# EasyEDA schematic SCH_ESC-capstone_2025-07-27.json
TITLE: ESC-capstone; REV: 1.0; Date: 2025-07-23; Sheet: 1/1; Drawn By: Atithep
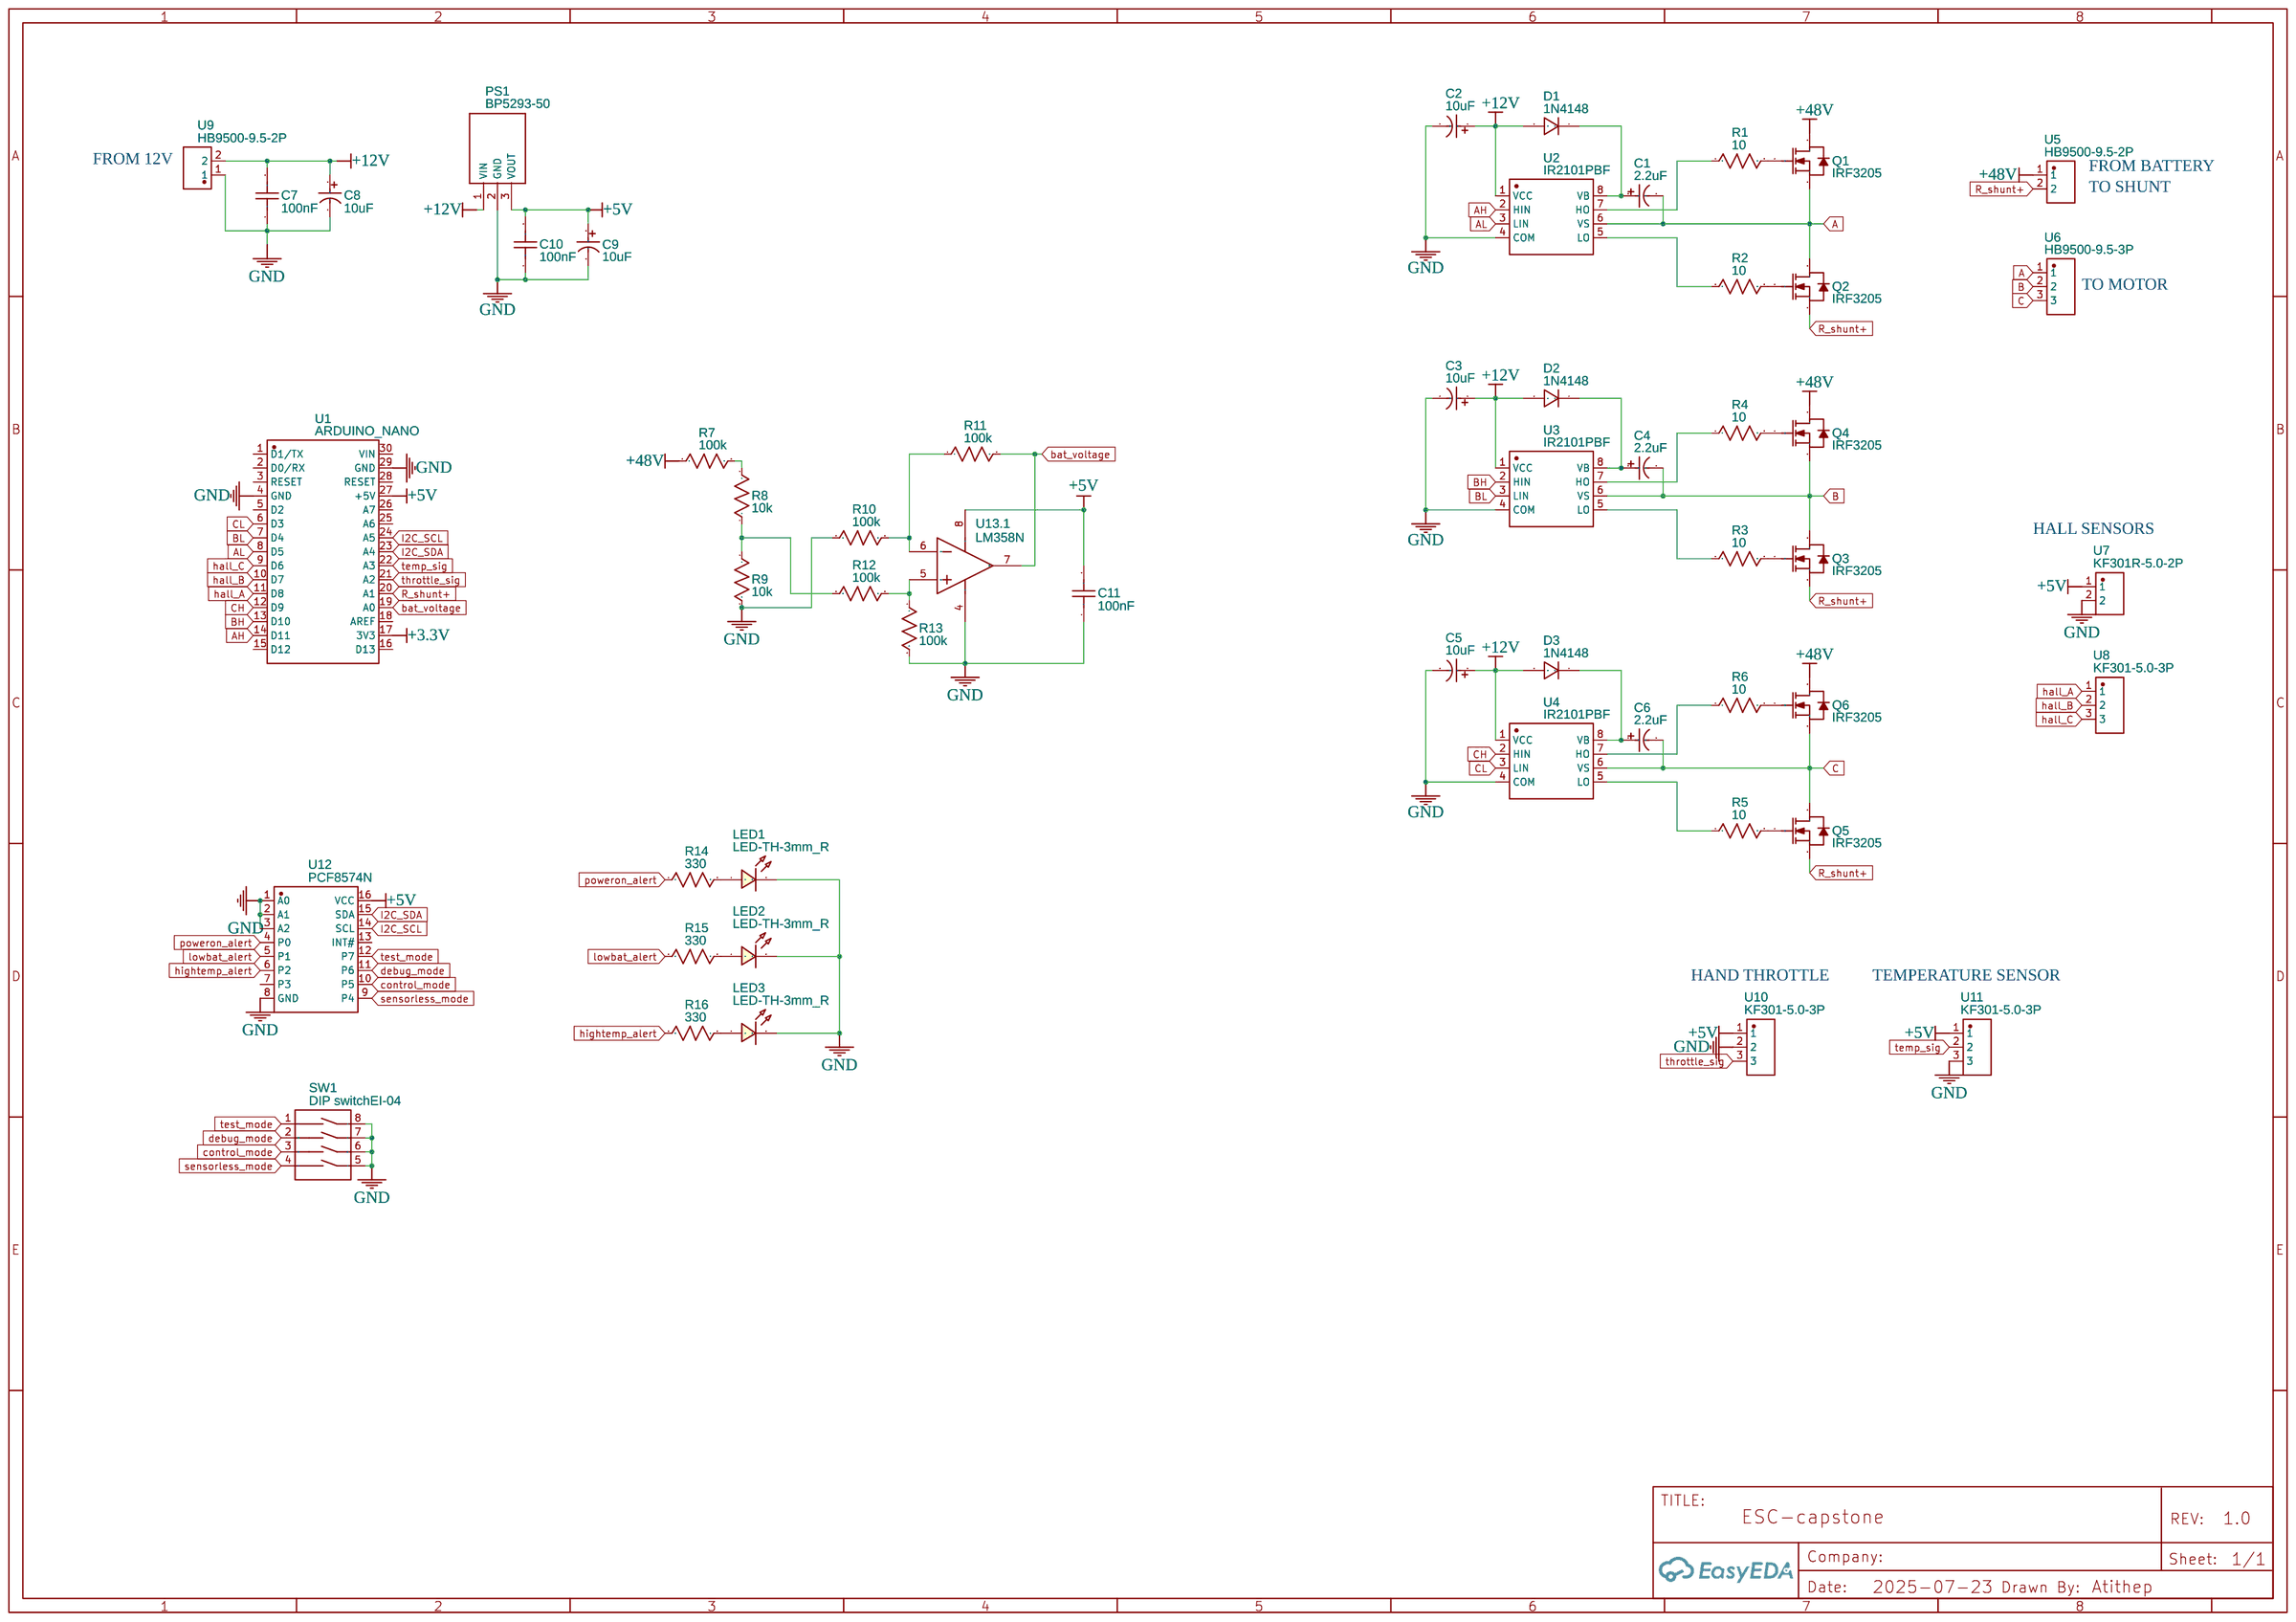
[diagram p0: schematic sheet]

## Parts
C1  2.2uF  [CAP-TH_BD5.0-P2.00-D0.8-FD]
C2  10uF  [CAP-TH_BD5.0-P2.00-D0.8-FD]
C3  10uF  [CAP-TH_BD5.0-P2.00-D0.8-FD]
C4  2.2uF  [CAP-TH_BD5.0-P2.00-D0.8-FD]
C5  10uF  [CAP-TH_BD5.0-P2.00-D0.8-FD]
C6  2.2uF  [CAP-TH_BD5.0-P2.00-D0.8-FD]
C7  100nF  [CAP-TH_L4.0-W3.5-P5.00-D0.5]
C8  10uF  [CAP-TH_BD5.0-P2.00-D0.8-FD]
C9  10uF  [CAP-TH_BD5.0-P2.00-D0.8-FD]
C10  100nF  [CAP-TH_L4.0-W3.5-P5.00-D0.5]
C11  100nF  [CAP-TH_L4.0-W3.5-P5.00-D0.5]
D1  1N4148  [DO-35_BD2.0-L4.2-P8.20-D0.5-RD]
D2  1N4148  [DO-35_BD2.0-L4.2-P8.20-D0.5-RD]
D3  1N4148  [DO-35_BD2.0-L4.2-P8.20-D0.5-RD]
LED1  LED-TH-3mm_R  [LED-TH_BD3.0_RED]
LED2  LED-TH-3mm_R  [LED-TH_BD3.0_RED]
LED3  LED-TH-3mm_R  [LED-TH_BD3.0_RED]
PS1  BP5293-50  [TO254P570X1700X1780-3P]
Q1  IRF3205  [TO-220-3_L10.0-W4.6-P2.54-L]
Q2  IRF3205  [TO-220-3_L10.0-W4.6-P2.54-L]
Q3  IRF3205  [TO-220-3_L10.0-W4.6-P2.54-L]
Q4  IRF3205  [TO-220-3_L10.0-W4.6-P2.54-L]
Q5  IRF3205  [TO-220-3_L10.0-W4.6-P2.54-L]
Q6  IRF3205  [TO-220-3_L10.0-W4.6-P2.54-L]
R1  10  [R_AXIAL-0.4]
R2  10  [R_AXIAL-0.4]
R3  10  [R_AXIAL-0.4]
R4  10  [R_AXIAL-0.4]
R5  10  [R_AXIAL-0.4]
R6  10  [R_AXIAL-0.4]
R7  100k  [R_AXIAL-0.4]
R8  10k  [R_AXIAL-0.4]
R9  10k  [R_AXIAL-0.4]
R10  100k  [R_AXIAL-0.4]
R11  100k  [R_AXIAL-0.4]
R12  100k  [R_AXIAL-0.4]
R13  100k  [R_AXIAL-0.4]
R14  330  [R_AXIAL-0.4]
R15  330  [R_AXIAL-0.4]
R16  330  [R_AXIAL-0.4]
SW1  DIP switchEI-04  [SW-TH_DIPSWITCHEI-04]
U1  ARDUINO_NANO  [COMM-TH_ARDUINO_NANO]
U2  IR2101PBF  [DIP-8_L9.9-W6.6-P2.54-LS7.62-BL]
U3  IR2101PBF  [DIP-8_L9.9-W6.6-P2.54-LS7.62-BL]
U4  IR2101PBF  [DIP-8_L9.9-W6.6-P2.54-LS7.62-BL]
U5  HB9500-9.5-2P  [CONN-TH_HB9500-9.5-2P]
U6  HB9500-9.5-3P  [CONN-TH_HB9500-9.5-3P]
U7  KF301R-5.0-2P  [CONN-TH_P5.00_KF301R-5.0-2P]
U8  KF301-5.0-3P  [CONN-TH_3P-P5.00_KF301-5.0-3P]
U9  HB9500-9.5-2P  [CONN-TH_HB9500-9.5-2P]
U10  KF301-5.0-3P  [CONN-TH_3P-P5.00_KF301-5.0-3P]
U11  KF301-5.0-3P  [CONN-TH_3P-P5.00_KF301-5.0-3P]
U12  PCF8574N  [PDIP-16_L19.3-W6.4-P2.54-LS7.9-BL]
U13  LM358N  [PDIP-8_L10.2-W5.9-P2.54-LS7.6-BL]  (section 1)

## Library data of the parts
C1-C6 C8 = 10uF 25V 5*11: Supplier: LCSC; Manufacturer: CX(承兴); Manufacturer Part: KM106M025D11RR0VH2FP0; Supplier Part: C43347; JLCPCB Part Class: Extended Part
C7 C10 C11 = RDER71H104K0M1H03A: Contributor: LCSC; Supplier: LCSC; Supplier Part: C527620; Manufacturer: muRata(村田); JLCPCB Part Class: Extended Part
C9 = 100uF 25V 5*11: Supplier: LCSC; Manufacturer: CX(承兴); Manufacturer Part: KM107M025D11RR0VH2FP0; Supplier Part: C47873; JLCPCB Part Class: Extended Part
D1-D3 = 1N4148: Supplier: LCSC; Supplier Part: C13769; Manufacturer: STMicroelectronics; Contributor: LCSC
LED1-LED3 = LED-TH-3mm_R: Manufacturer: EVERLIGHT(台湾亿光); Manufacturer Part: 204-10SDRD/S530-A3-L; Supplier Part: C84774; Supplier: LCSC; Contributor: LCEDA_Lib
PS1 = BP5293-50: Contributor: zerozaber2
Q1-Q6 = IRF3205: Supplier: LCSC; Supplier Part: C19189952; Manufacturer: minos(迈诺斯); Contributor: lcsc; JLCPCB Part Class: Extended Part
R1-R16 = R_AXIAL-0.4_US: Contributor: LCEDA_Lib
SW1 = DIP switchEI-04: Supplier: LCSC; Manufacturer: 圜达; Manufacturer Part: 拨码开关EI-04; Supplier Part: C99987; JLCPCB Part Class: Extended Part
U1 = ARDUINO_NANO: Contributor: lcsc; Supplier: LCSC; Supplier Part: C9900017879; Manufacturer: null; JLCPCB Part Class: Extended Part
U2-U4 = IR2101PBF: Supplier: LCSC; Manufacturer: Infineon(英飞凌); Supplier Part: C2955; JLCPCB Part Class: Extended Part
U5 U9 = HB9500-9.5-2P: Contributor: LCSC; Supplier: LCSC; Supplier Part: C707836; Manufacturer: KEFA(科发); JLCPCB Part Class: Extended Part
U6 = HB9500-9.5-3P: Contributor: LCSC; Supplier: LCSC; Supplier Part: C707837; Manufacturer: KEFA(科发); JLCPCB Part Class: Extended Part
U7 = KF301R-5.0-2P: Contributor: LCSC; Supplier: LCSC; Supplier Part: C474883; Manufacturer: KEFA(科发); JLCPCB Part Class: Extended Part
U8 U10 U11 = KF301-5.0-3P: Contributor: LCSC; Supplier: LCSC; Supplier Part: C474882; Manufacturer: KEFA(科发); JLCPCB Part Class: Extended Part
U12 = PCF8574N: Contributor: LCSC; Supplier: LCSC; Supplier Part: C2879047; Manufacturer: TI(德州仪器); JLCPCB Part Class: Extended Part
U13 = LM358N: subpart_no: 1; Supplier: LCSC; Supplier Part: C83405; Manufacturer: TI(德州仪器); Manufacturer Part: LM358N/NOPB; JLCPCB Part Class: Extended Part

## Nets
+3.3V: U1.17(3V3)
+5V: C9.1 C10.2 C11.2 PS1.3(VOUT) U1.27(+5V) U7.1 U10.1 U11.1 U12.16(VCC) U13.8(+V)
+12V: C2.1 C3.1 C5.1 C7.2 C8.1 D1.2 D2.2 D3.2 PS1.1(VIN) U2.1(VCC) U3.1(VCC) U4.1(VCC) U9.2
+48V: Q1.2(D) Q4.2(D) Q6.2(D) R7.1 U5.1
GND: C2.2 C3.2 C5.2 C7.1 C8.2 C9.2 C10.1 C11.1 LED1.2 LED2.2 LED3.2 PS1.2(GND) R9.2 R10.1 R13.2 SW1.5 SW1.6 SW1.7 SW1.8 U1.4(GND) U1.29(GND) U2.4(COM) U3.4(COM) U4.4(COM) U7.2 U9.1 U10.2 U11.3 U12.1(A0) U12.2(A1) U12.3(A2) U12.8(GND) U13.4(-V)
A: C1.2 Q1.3(S) Q2.2(D) U2.6(VS) U6.1
AH: U1.14(D11) U2.2(HIN)
AL: U1.8(D5) U2.3(LIN)
B: C4.2 Q3.2(D) Q4.3(S) U3.6(VS) U6.2
bat_voltage: R11.2 U1.19(A0) U13.7(OUT 2)
BH: U1.13(D10) U3.2(HIN)
BL: U1.7(D4) U3.3(LIN)
C: C6.2 Q5.2(D) Q6.3(S) U4.6(VS) U6.3
CH: U1.12(D9) U4.2(HIN)
CL: U1.6(D3) U4.3(LIN)
control_mode: SW1.3 U12.10(P5)
debug_mode: SW1.2 U12.11(P6)
hall_A: U1.11(D8) U8.1
hall_B: U1.10(D7) U8.2
hall_C: U1.9(D6) U8.3
hightemp_alert: R16.1 U12.6(P2)
I2C_SCL: U1.24(A5) U12.14(SCL)
I2C_SDA: U1.23(A4) U12.15(SDA)
lowbat_alert: R15.1 U12.5(P1)
poweron_alert: R14.1 U12.4(P0)
R_shunt+: Q2.3(S) Q3.3(S) Q5.3(S) U1.20(A1) U5.2
sensorless_mode: SW1.4 U12.9(P4)
temp_sig: U1.22(A3) U11.2
test_mode: SW1.1 U12.12(P7)
throttle_sig: U1.21(A2) U10.3
Net-(C1-1): C1.1 D1.1 U2.8(VB)
Net-(C4-1): C4.1 D2.1 U3.8(VB)
Net-(C6-1): C6.1 D3.1 U4.8(VB)
Net-(LED1-1): LED1.1 R14.2
Net-(LED2-1): LED2.1 R15.2
Net-(LED3-1): LED3.1 R16.2
Net-(Q1-1): Q1.1(G) R1.2
Net-(Q2-1): Q2.1(G) R2.2
Net-(Q3-1): Q3.1(G) R3.2
Net-(Q4-1): Q4.1(G) R4.2
Net-(Q5-1): Q5.1(G) R5.2
Net-(Q6-1): Q6.1(G) R6.2
Net-(R1-1): R1.1 U2.7(HO)
Net-(R2-1): R2.1 U2.5(LO)
Net-(R3-1): R3.1 U3.5(LO)
Net-(R4-1): R4.1 U3.7(HO)
Net-(R5-1): R5.1 U4.5(LO)
Net-(R6-1): R6.1 U4.7(HO)
Net-(R7-2): R7.2 R8.2
Net-(R8-1): R8.1 R9.1 R12.1
Net-(R10-2): R10.2 R11.1 U13.6(-IN 2)
Net-(R12-2): R12.2 R13.1 U13.5(+IN 2)

Not connected (* = marked no-connect by the designer): U1 1(D1/TX) 2(D0/RX) 3(RESET) 5(D2) 15(D12) 16(D13) 18(AREF) 25(A6) 26(A7) 28(RESET) 30(VIN); U12 7(P3) 13(INT#)

## Notes on the sheet
- FROM 12V
- FROM BATTERY
- TO SHUNT
- TO MOTOR
- HALL SENSORS
- HAND THROTTLE
- TEMPERATURE SENSOR
